# EasyEDA schematic SCH_MCP23017 usb to ttl_2021-07-08.json
TITLE: Sheet_1; REV: 1.0; Date: 2021-06-05; Sheet: 1/1; Drawn By: limchengwei; Company: Your Company
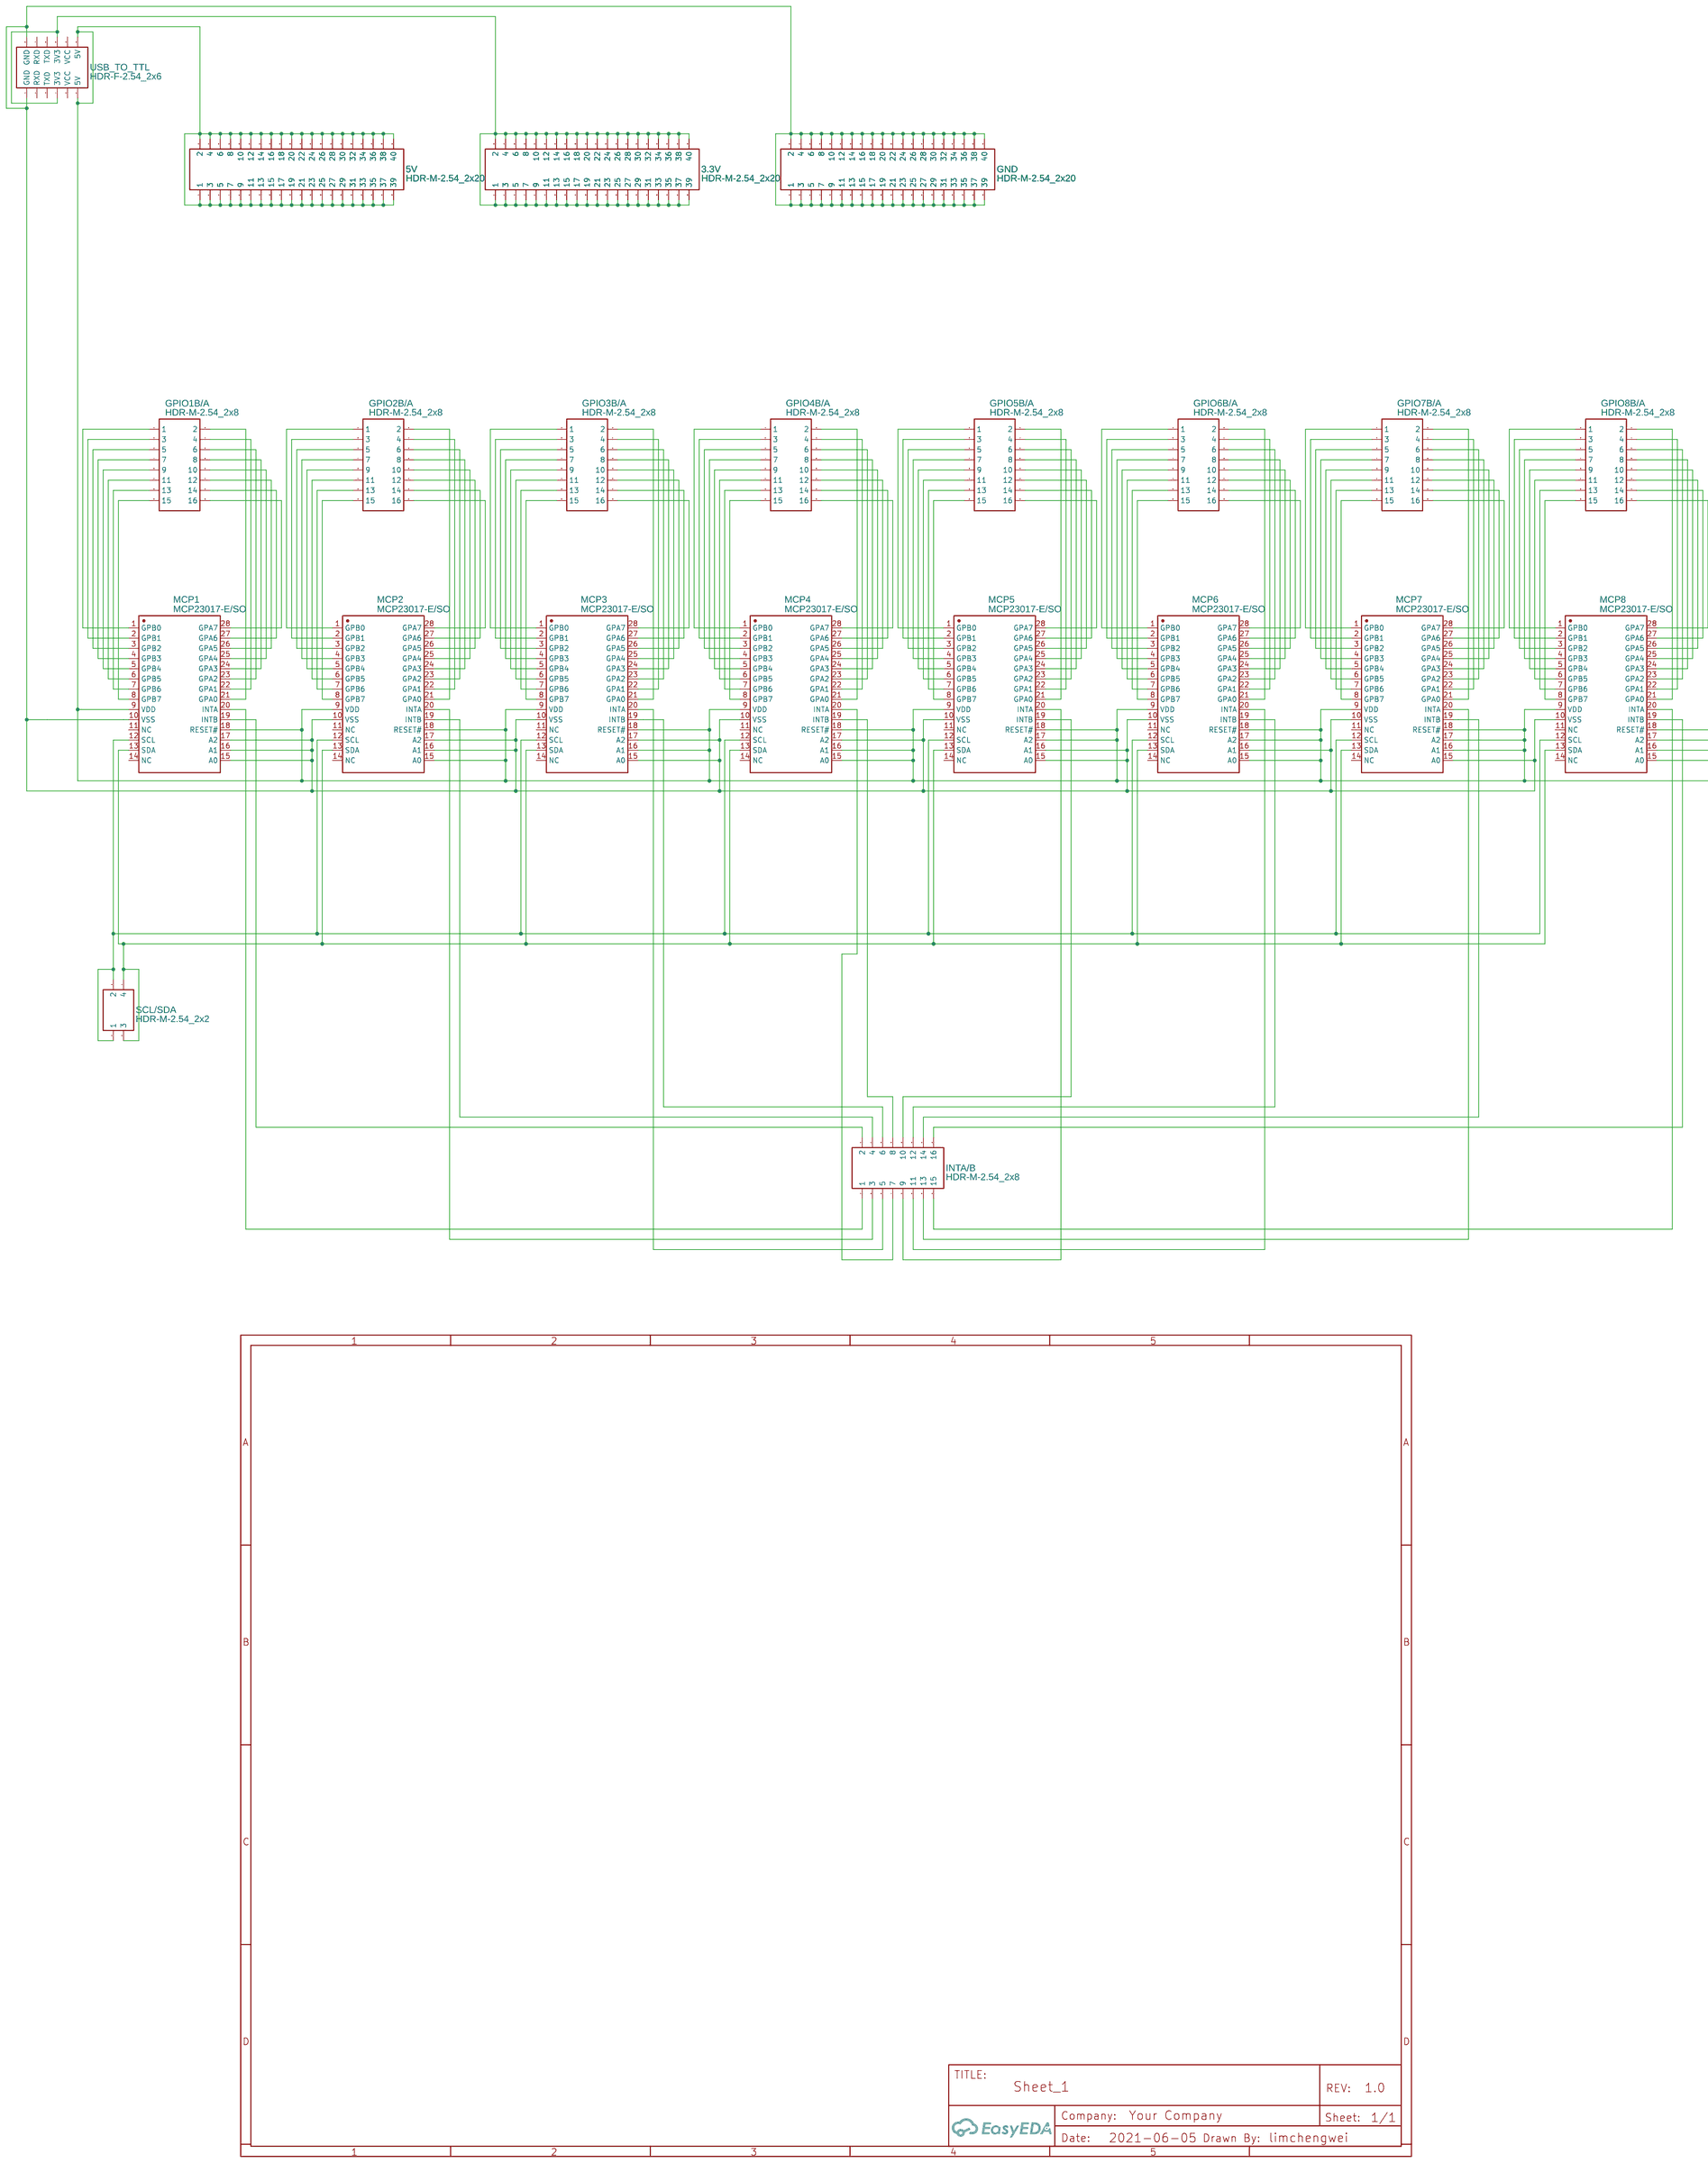
[diagram p0: schematic sheet]

## Parts
3.3V  HDR-M-2.54_2x20  [HDR-M-2.54_2X20]
5V  HDR-M-2.54_2x20  [HDR-M-2.54_2X20]
GND  HDR-M-2.54_2x20  [HDR-M-2.54_2X20]
GPIO1B/A  HDR-M-2.54_2x8  [HDR-M-2.54_2X8]
GPIO2B/A  HDR-M-2.54_2x8  [HDR-M-2.54_2X8]
GPIO3B/A  HDR-M-2.54_2x8  [HDR-M-2.54_2X8]
GPIO4B/A  HDR-M-2.54_2x8  [HDR-M-2.54_2X8]
GPIO5B/A  HDR-M-2.54_2x8  [HDR-M-2.54_2X8]
GPIO6B/A  HDR-M-2.54_2x8  [HDR-M-2.54_2X8]
GPIO7B/A  HDR-M-2.54_2x8  [HDR-M-2.54_2X8]
GPIO8B/A  HDR-M-2.54_2x8  [HDR-M-2.54_2X8]
INTA/B  HDR-M-2.54_2x8  [HDR-M-2.54_2X8]
MCP1  MCP23017-E/SO  [SOIC-28_L18.1-W10.3-P1.27-LS10.3-BL]
MCP2  MCP23017-E/SO  [SOIC-28_L18.1-W10.3-P1.27-LS10.3-BL]
MCP3  MCP23017-E/SO  [SOIC-28_L18.1-W10.3-P1.27-LS10.3-BL]
MCP4  MCP23017-E/SO  [SOIC-28_L18.1-W10.3-P1.27-LS10.3-BL]
MCP5  MCP23017-E/SO  [SOIC-28_L18.1-W10.3-P1.27-LS10.3-BL]
MCP6  MCP23017-E/SO  [SOIC-28_L18.1-W10.3-P1.27-LS10.3-BL]
MCP7  MCP23017-E/SO  [SOIC-28_L18.1-W10.3-P1.27-LS10.3-BL]
MCP8  MCP23017-E/SO  [SOIC-28_L18.1-W10.3-P1.27-LS10.3-BL]
SCL/SDA  HDR-M-2.54_2x2  [HDR-M-2.54_2X2]
USB_TO_TTL  HDR-F-2.54_2x6  [HDR-F-2.54_2X6]

## Library data of the parts
3.3V 5V GND = HDR-M-2.54_2x20: Supplier Part: C50980; Supplier: LCSC; Contributor: LCEDA_Lib
GPIO1B/A GPIO2B/A GPIO3B/A GPIO4B/A GPIO5B/A GPIO6B/A GPIO7B/A GPIO8B/A INTA/B = HDR-M-2.54_2x8: Supplier Part: C68234; Supplier: LCSC; Contributor: LCEDA_Lib
MCP1-MCP8 = MCP23017-E/SO: Supplier: LCSC; Manufacturer: MICROCHIP; Contributor: LCSC; Supplier Part: C47023; JLCPCB Part Class: Extended Part
SCL/SDA = HDR-M-2.54_2x2: Supplier Part: C66690; Supplier: LCSC; Contributor: LCEDA_Lib
USB_TO_TTL = HDR-F-2.54_2x6: Supplier Part: C36191; Supplier: LCSC; Contributor: LCEDA_Lib

## Nets
Net-(3.3V-1): 3.3V.1 3.3V.2 3.3V.3 3.3V.4 3.3V.5 3.3V.6 3.3V.7 3.3V.8 3.3V.9 3.3V.10 3.3V.11 3.3V.12 3.3V.13 3.3V.14 3.3V.15 3.3V.16 3.3V.17 3.3V.18 3.3V.19 3.3V.20 3.3V.21 3.3V.22 3.3V.23 3.3V.24 3.3V.25 3.3V.26 3.3V.27 3.3V.28 3.3V.29 3.3V.30 3.3V.31 3.3V.32 3.3V.33 3.3V.34 3.3V.35 3.3V.36 3.3V.37 3.3V.38 3.3V.39 3.3V.40 USB_TO_TTL.7(3V3) USB_TO_TTL.8(3V3)
Net-(5V-1): 5V.1 5V.2 5V.3 5V.4 5V.5 5V.6 5V.7 5V.8 5V.9 5V.10 5V.11 5V.12 5V.13 5V.14 5V.15 5V.16 5V.17 5V.18 5V.19 5V.20 5V.21 5V.22 5V.23 5V.24 5V.25 5V.26 5V.27 5V.28 5V.29 5V.30 5V.31 5V.32 5V.33 5V.34 5V.35 5V.36 5V.37 5V.38 5V.39 5V.40 MCP1.9(VDD) MCP1.18(RESET#) MCP2.9(VDD) MCP2.15(A0) MCP2.18(RESET#) MCP3.9(VDD) MCP3.16(A1) MCP3.18(RESET#) MCP4.9(VDD) MCP4.15(A0) MCP4.16(A1) MCP4.18(RESET#) MCP5.9(VDD) MCP5.17(A2) MCP5.18(RESET#) MCP6.9(VDD) MCP6.15(A0) MCP6.17(A2) MCP6.18(RESET#) MCP7.9(VDD) MCP7.16(A1) MCP7.17(A2) MCP7.18(RESET#) MCP8.9(VDD) MCP8.15(A0) MCP8.16(A1) MCP8.17(A2) MCP8.18(RESET#) USB_TO_TTL.11(5V) USB_TO_TTL.12(5V)
Net-(GND-1): GND.1 GND.2 GND.3 GND.4 GND.5 GND.6 GND.7 GND.8 GND.9 GND.10 GND.11 GND.12 GND.13 GND.14 GND.15 GND.16 GND.17 GND.18 GND.19 GND.20 GND.21 GND.22 GND.23 GND.24 GND.25 GND.26 GND.27 GND.28 GND.29 GND.30 GND.31 GND.32 GND.33 GND.34 GND.35 GND.36 GND.37 GND.38 GND.39 GND.40 MCP1.10(VSS) MCP1.15(A0) MCP1.16(A1) MCP1.17(A2) MCP2.10(VSS) MCP2.16(A1) MCP2.17(A2) MCP3.10(VSS) MCP3.15(A0) MCP3.17(A2) MCP4.10(VSS) MCP4.17(A2) MCP5.10(VSS) MCP5.15(A0) MCP5.16(A1) MCP6.10(VSS) MCP6.16(A1) MCP7.10(VSS) MCP7.15(A0) MCP8.10(VSS) USB_TO_TTL.1(GND) USB_TO_TTL.2(GND)
Net-(GPIO1B/A-1): GPIO1B/A.1 MCP1.1(GPB0)
Net-(GPIO1B/A-2): GPIO1B/A.2 MCP1.21(GPA0)
Net-(GPIO1B/A-3): GPIO1B/A.3 MCP1.2(GPB1)
Net-(GPIO1B/A-4): GPIO1B/A.4 MCP1.22(GPA1)
Net-(GPIO1B/A-5): GPIO1B/A.5 MCP1.3(GPB2)
Net-(GPIO1B/A-6): GPIO1B/A.6 MCP1.23(GPA2)
Net-(GPIO1B/A-7): GPIO1B/A.7 MCP1.4(GPB3)
Net-(GPIO1B/A-8): GPIO1B/A.8 MCP1.24(GPA3)
Net-(GPIO1B/A-9): GPIO1B/A.9 MCP1.5(GPB4)
Net-(GPIO1B/A-10): GPIO1B/A.10 MCP1.25(GPA4)
Net-(GPIO1B/A-11): GPIO1B/A.11 MCP1.6(GPB5)
Net-(GPIO1B/A-12): GPIO1B/A.12 MCP1.26(GPA5)
Net-(GPIO1B/A-13): GPIO1B/A.13 MCP1.7(GPB6)
Net-(GPIO1B/A-14): GPIO1B/A.14 MCP1.27(GPA6)
Net-(GPIO1B/A-15): GPIO1B/A.15 MCP1.8(GPB7)
Net-(GPIO1B/A-16): GPIO1B/A.16 MCP1.28(GPA7)
Net-(GPIO2B/A-1): GPIO2B/A.1 MCP2.1(GPB0)
Net-(GPIO2B/A-2): GPIO2B/A.2 MCP2.21(GPA0)
Net-(GPIO2B/A-3): GPIO2B/A.3 MCP2.2(GPB1)
Net-(GPIO2B/A-4): GPIO2B/A.4 MCP2.22(GPA1)
Net-(GPIO2B/A-5): GPIO2B/A.5 MCP2.3(GPB2)
Net-(GPIO2B/A-6): GPIO2B/A.6 MCP2.23(GPA2)
Net-(GPIO2B/A-7): GPIO2B/A.7 MCP2.4(GPB3)
Net-(GPIO2B/A-8): GPIO2B/A.8 MCP2.24(GPA3)
Net-(GPIO2B/A-9): GPIO2B/A.9 MCP2.5(GPB4)
Net-(GPIO2B/A-10): GPIO2B/A.10 MCP2.25(GPA4)
Net-(GPIO2B/A-11): GPIO2B/A.11 MCP2.6(GPB5)
Net-(GPIO2B/A-12): GPIO2B/A.12 MCP2.26(GPA5)
Net-(GPIO2B/A-13): GPIO2B/A.13 MCP2.7(GPB6)
Net-(GPIO2B/A-14): GPIO2B/A.14 MCP2.27(GPA6)
Net-(GPIO2B/A-15): GPIO2B/A.15 MCP2.8(GPB7)
Net-(GPIO2B/A-16): GPIO2B/A.16 MCP2.28(GPA7)
Net-(GPIO3B/A-1): GPIO3B/A.1 MCP3.1(GPB0)
Net-(GPIO3B/A-2): GPIO3B/A.2 MCP3.21(GPA0)
Net-(GPIO3B/A-3): GPIO3B/A.3 MCP3.2(GPB1)
Net-(GPIO3B/A-4): GPIO3B/A.4 MCP3.22(GPA1)
Net-(GPIO3B/A-5): GPIO3B/A.5 MCP3.3(GPB2)
Net-(GPIO3B/A-6): GPIO3B/A.6 MCP3.23(GPA2)
Net-(GPIO3B/A-7): GPIO3B/A.7 MCP3.4(GPB3)
Net-(GPIO3B/A-8): GPIO3B/A.8 MCP3.24(GPA3)
Net-(GPIO3B/A-9): GPIO3B/A.9 MCP3.5(GPB4)
Net-(GPIO3B/A-10): GPIO3B/A.10 MCP3.25(GPA4)
Net-(GPIO3B/A-11): GPIO3B/A.11 MCP3.6(GPB5)
Net-(GPIO3B/A-12): GPIO3B/A.12 MCP3.26(GPA5)
Net-(GPIO3B/A-13): GPIO3B/A.13 MCP3.7(GPB6)
Net-(GPIO3B/A-14): GPIO3B/A.14 MCP3.27(GPA6)
Net-(GPIO3B/A-15): GPIO3B/A.15 MCP3.8(GPB7)
Net-(GPIO3B/A-16): GPIO3B/A.16 MCP3.28(GPA7)
Net-(GPIO4B/A-1): GPIO4B/A.1 MCP4.1(GPB0)
Net-(GPIO4B/A-2): GPIO4B/A.2 MCP4.21(GPA0)
Net-(GPIO4B/A-3): GPIO4B/A.3 MCP4.2(GPB1)
Net-(GPIO4B/A-4): GPIO4B/A.4 MCP4.22(GPA1)
Net-(GPIO4B/A-5): GPIO4B/A.5 MCP4.3(GPB2)
Net-(GPIO4B/A-6): GPIO4B/A.6 MCP4.23(GPA2)
Net-(GPIO4B/A-7): GPIO4B/A.7 MCP4.4(GPB3)
Net-(GPIO4B/A-8): GPIO4B/A.8 MCP4.24(GPA3)
Net-(GPIO4B/A-9): GPIO4B/A.9 MCP4.5(GPB4)
Net-(GPIO4B/A-10): GPIO4B/A.10 MCP4.25(GPA4)
Net-(GPIO4B/A-11): GPIO4B/A.11 MCP4.6(GPB5)
Net-(GPIO4B/A-12): GPIO4B/A.12 MCP4.26(GPA5)
Net-(GPIO4B/A-13): GPIO4B/A.13 MCP4.7(GPB6)
Net-(GPIO4B/A-14): GPIO4B/A.14 MCP4.27(GPA6)
Net-(GPIO4B/A-15): GPIO4B/A.15 MCP4.8(GPB7)
Net-(GPIO4B/A-16): GPIO4B/A.16 MCP4.28(GPA7)
Net-(GPIO5B/A-1): GPIO5B/A.1 MCP5.1(GPB0)
Net-(GPIO5B/A-2): GPIO5B/A.2 MCP5.21(GPA0)
Net-(GPIO5B/A-3): GPIO5B/A.3 MCP5.2(GPB1)
Net-(GPIO5B/A-4): GPIO5B/A.4 MCP5.22(GPA1)
Net-(GPIO5B/A-5): GPIO5B/A.5 MCP5.3(GPB2)
Net-(GPIO5B/A-6): GPIO5B/A.6 MCP5.23(GPA2)
Net-(GPIO5B/A-7): GPIO5B/A.7 MCP5.4(GPB3)
Net-(GPIO5B/A-8): GPIO5B/A.8 MCP5.24(GPA3)
Net-(GPIO5B/A-9): GPIO5B/A.9 MCP5.5(GPB4)
Net-(GPIO5B/A-10): GPIO5B/A.10 MCP5.25(GPA4)
Net-(GPIO5B/A-11): GPIO5B/A.11 MCP5.6(GPB5)
Net-(GPIO5B/A-12): GPIO5B/A.12 MCP5.26(GPA5)
Net-(GPIO5B/A-13): GPIO5B/A.13 MCP5.7(GPB6)
Net-(GPIO5B/A-14): GPIO5B/A.14 MCP5.27(GPA6)
Net-(GPIO5B/A-15): GPIO5B/A.15 MCP5.8(GPB7)
Net-(GPIO5B/A-16): GPIO5B/A.16 MCP5.28(GPA7)
Net-(GPIO6B/A-1): GPIO6B/A.1 MCP6.1(GPB0)
Net-(GPIO6B/A-2): GPIO6B/A.2 MCP6.21(GPA0)
Net-(GPIO6B/A-3): GPIO6B/A.3 MCP6.2(GPB1)
Net-(GPIO6B/A-4): GPIO6B/A.4 MCP6.22(GPA1)
Net-(GPIO6B/A-5): GPIO6B/A.5 MCP6.3(GPB2)
Net-(GPIO6B/A-6): GPIO6B/A.6 MCP6.23(GPA2)
Net-(GPIO6B/A-7): GPIO6B/A.7 MCP6.4(GPB3)
Net-(GPIO6B/A-8): GPIO6B/A.8 MCP6.24(GPA3)
Net-(GPIO6B/A-9): GPIO6B/A.9 MCP6.5(GPB4)
Net-(GPIO6B/A-10): GPIO6B/A.10 MCP6.25(GPA4)
Net-(GPIO6B/A-11): GPIO6B/A.11 MCP6.6(GPB5)
Net-(GPIO6B/A-12): GPIO6B/A.12 MCP6.26(GPA5)
Net-(GPIO6B/A-13): GPIO6B/A.13 MCP6.7(GPB6)
Net-(GPIO6B/A-14): GPIO6B/A.14 MCP6.27(GPA6)
Net-(GPIO6B/A-15): GPIO6B/A.15 MCP6.8(GPB7)
Net-(GPIO6B/A-16): GPIO6B/A.16 MCP6.28(GPA7)
Net-(GPIO7B/A-1): GPIO7B/A.1 MCP7.1(GPB0)
Net-(GPIO7B/A-2): GPIO7B/A.2 MCP7.21(GPA0)
Net-(GPIO7B/A-3): GPIO7B/A.3 MCP7.2(GPB1)
Net-(GPIO7B/A-4): GPIO7B/A.4 MCP7.22(GPA1)
Net-(GPIO7B/A-5): GPIO7B/A.5 MCP7.3(GPB2)
Net-(GPIO7B/A-6): GPIO7B/A.6 MCP7.23(GPA2)
Net-(GPIO7B/A-7): GPIO7B/A.7 MCP7.4(GPB3)
Net-(GPIO7B/A-8): GPIO7B/A.8 MCP7.24(GPA3)
Net-(GPIO7B/A-9): GPIO7B/A.9 MCP7.5(GPB4)
Net-(GPIO7B/A-10): GPIO7B/A.10 MCP7.25(GPA4)
Net-(GPIO7B/A-11): GPIO7B/A.11 MCP7.6(GPB5)
Net-(GPIO7B/A-12): GPIO7B/A.12 MCP7.26(GPA5)
Net-(GPIO7B/A-13): GPIO7B/A.13 MCP7.7(GPB6)
Net-(GPIO7B/A-14): GPIO7B/A.14 MCP7.27(GPA6)
Net-(GPIO7B/A-15): GPIO7B/A.15 MCP7.8(GPB7)
Net-(GPIO7B/A-16): GPIO7B/A.16 MCP7.28(GPA7)
Net-(GPIO8B/A-1): GPIO8B/A.1 MCP8.1(GPB0)
Net-(GPIO8B/A-2): GPIO8B/A.2 MCP8.21(GPA0)
Net-(GPIO8B/A-3): GPIO8B/A.3 MCP8.2(GPB1)
Net-(GPIO8B/A-4): GPIO8B/A.4 MCP8.22(GPA1)
Net-(GPIO8B/A-5): GPIO8B/A.5 MCP8.3(GPB2)
Net-(GPIO8B/A-6): GPIO8B/A.6 MCP8.23(GPA2)
Net-(GPIO8B/A-7): GPIO8B/A.7 MCP8.4(GPB3)
Net-(GPIO8B/A-8): GPIO8B/A.8 MCP8.24(GPA3)
Net-(GPIO8B/A-9): GPIO8B/A.9 MCP8.5(GPB4)
Net-(GPIO8B/A-10): GPIO8B/A.10 MCP8.25(GPA4)
Net-(GPIO8B/A-11): GPIO8B/A.11 MCP8.6(GPB5)
Net-(GPIO8B/A-12): GPIO8B/A.12 MCP8.26(GPA5)
Net-(GPIO8B/A-13): GPIO8B/A.13 MCP8.7(GPB6)
Net-(GPIO8B/A-14): GPIO8B/A.14 MCP8.27(GPA6)
Net-(GPIO8B/A-15): GPIO8B/A.15 MCP8.8(GPB7)
Net-(GPIO8B/A-16): GPIO8B/A.16 MCP8.28(GPA7)
Net-(INTA/B-1): INTA/B.1 MCP1.20(INTA)
Net-(INTA/B-2): INTA/B.2 MCP1.19(INTB)
Net-(INTA/B-3): INTA/B.3 MCP2.20(INTA)
Net-(INTA/B-4): INTA/B.4 MCP2.19(INTB)
Net-(INTA/B-5): INTA/B.5 MCP3.20(INTA)
Net-(INTA/B-6): INTA/B.6 MCP3.19(INTB)
Net-(INTA/B-7): INTA/B.7 MCP4.20(INTA)
Net-(INTA/B-8): INTA/B.8 MCP4.19(INTB)
Net-(INTA/B-9): INTA/B.9 MCP5.20(INTA)
Net-(INTA/B-10): INTA/B.10 MCP5.19(INTB)
Net-(INTA/B-11): INTA/B.11 MCP6.20(INTA)
Net-(INTA/B-12): INTA/B.12 MCP6.19(INTB)
Net-(INTA/B-13): INTA/B.13 MCP7.20(INTA)
Net-(INTA/B-14): INTA/B.14 MCP7.19(INTB)
Net-(INTA/B-15): INTA/B.15 MCP8.20(INTA)
Net-(INTA/B-16): INTA/B.16 MCP8.19(INTB)
Net-(MCP1-12): MCP1.12(SCL) MCP2.12(SCL) MCP3.12(SCL) MCP4.12(SCL) MCP5.12(SCL) MCP6.12(SCL) MCP7.12(SCL) MCP8.12(SCL) SCL/SDA.1 SCL/SDA.2
Net-(MCP1-13): MCP1.13(SDA) MCP2.13(SDA) MCP3.13(SDA) MCP4.13(SDA) MCP5.13(SDA) MCP6.13(SDA) MCP7.13(SDA) MCP8.13(SDA) SCL/SDA.3 SCL/SDA.4

Not connected (* = marked no-connect by the designer): MCP1 11(NC) 14(NC); MCP2 11(NC) 14(NC); MCP3 11(NC) 14(NC); MCP4 11(NC) 14(NC); MCP5 11(NC) 14(NC); MCP6 11(NC) 14(NC); MCP7 11(NC) 14(NC); MCP8 11(NC) 14(NC); USB_TO_TTL 3(RXD) 4(RXD) 5(TXD) 6(TXD) 9(VCC) 10(VCC)
